# Altium schematic sheet EIS_Main_MSP430F6638.SchDoc: EIS: CPU
size A4; FaxNumber: +49 7721 943 210; Organization: Hahn-Schickard; Address1: Wilhelm-Schickard-Str. 10; Address2: 78052 Villingen-Schwenningen; Address3: Bernd.Ehrbrecht@Hahn-Schickard.de; DocumentNumber: 1; Revision: 1.0; SheetNumber: 2; SheetTotal: 7; PhoneNumber: 0 7721 943 137; E-Mail: Xxxx.Xxxx@Hahn-Schickard.de; ProjectName: Project File Name
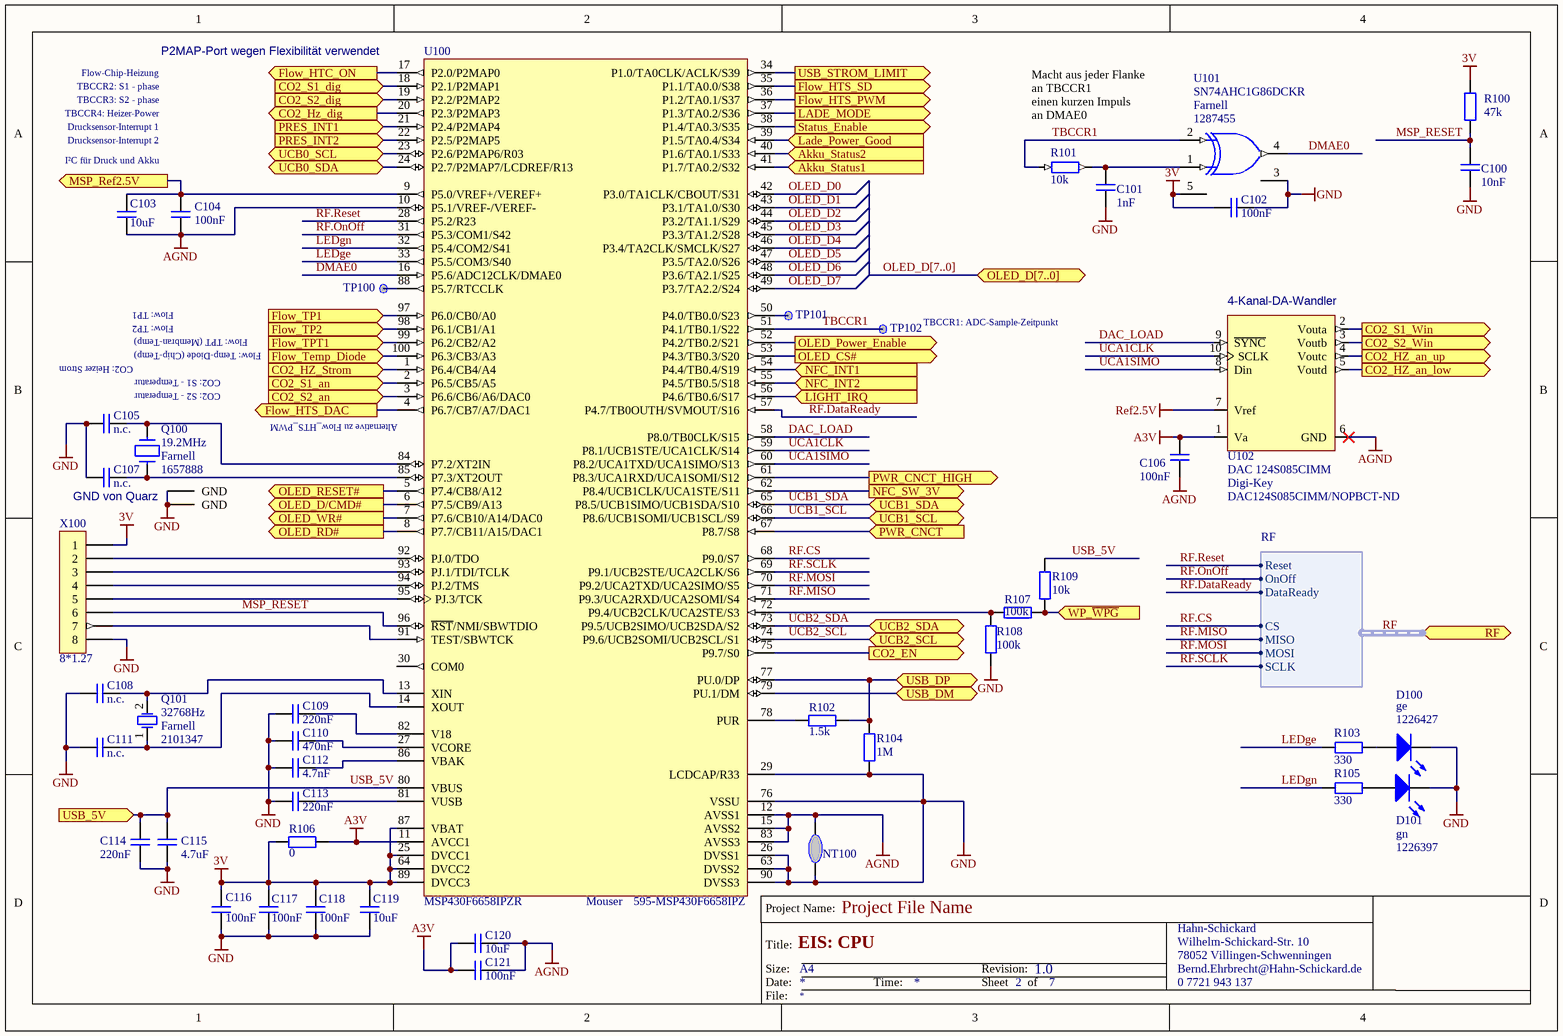
[diagram p0: EIS_Main_MSP430F6638.SchDoc]

## Parts
C100  10nF  [CAPC1608N]
C101  1nF  [CAPC1608N]
C102  100nF  [CAPC1608N]
C103  10uF  [CAPC1608N]
C104  100nF  [CAPC1608N]
C105  n.c.  [CAPC1608N]
C106  100nF  [CAPC1608N]
C107  n.c.  [CAPC1608N]
C108  n.c.  [CAPC1608N]
C109  220nF  [CAPC1608N]
C110  470nF  [CAPC1608N]
C111  n.c.  [CAPC1608N]
C112  4.7nF  [CAPC1608N]
C113  220nF  [CAPC1608N]
C114  220nF  [CAPC1608N]
C115  4.7uF  [CAPC1608N]
C116  100nF  [CAPC1608N]
C117  100nF  [CAPC1608N]
C118  100nF  [CAPC1608N]
C119  10uF  [CAPC1608N]
C120  10uF  [CAPC1608N]
C121  100nF  [CAPC1608N]
D100  ge  Supplier Part Number 1: 1226427  [LED-Gelb]
D101  gn  Supplier Part Number 1: 1226397  [LED-gruen]
NT100  Net Tie without Boom  [NetTie]  (value not drawn)  (net tie, no BOM)
Q100  19.2MHz  Supplier 1: Farnell  Supplier Part Number 1: 1657888  [Quarz 4 Pin 2.5mm*2mm]
Q101  32768Hz  Supplier 1: Farnell  Supplier Part Number 1: 2101347  [ABS07]
R100  47k  [RESC1608N]
R101  10k  [RESC1608N]
R102  1.5k  [RESC1608N]
R103  330  [RESC1608N]
R104  1M  [RESC1608N]
R105  330  [RESC1608N]
R106  0  [RESC1608N]
R107  100k  [RESC1608N]
R108  100k  [RESC1608N]
R109  10k  [RESC1608N]
TP100  Testpoint 1mm  [Testpoint 1mm]  (value not drawn)  (no BOM)
TP101  Testpoint 1mm  [Testpoint 1mm]  (value not drawn)  (no BOM)
TP102  Testpoint 1mm  [Testpoint 1mm]  (value not drawn)  (no BOM)
U100  MSP430F6658IPZR  Supplier 1: Mouser  Supplier Part Number 1: 595-MSP430F6658IPZ  [TI-PZ100_N]
U101  SN74AHC1G86DCKR  Supplier 1: Farnell  Supplier Part Number 1: 1287455  [419A-01_N]
U102  DAC 124S085CIMM  Supplier1: Digi-Key  Supplier Part Number 1: DAC124S085CIMM/NOPBCT-ND  [MSOP-DGS]
X100  8*1.27  [JMP 8x1.27]

## Ports
Akku_Status1 (in), Akku_Status2 (in), CO2_EN (out), CO2_HZ_an_low (out), CO2_HZ_an_up (out), CO2_Hz_dig (out), CO2_HZ_Strom (in), CO2_S1_an (in), CO2_S1_dig (in), CO2_S1_Win (out), CO2_S2_an (in), CO2_S2_dig (in), CO2_S2_Win (out), Flow_HTC_ON (out), Flow_HTS_DAC (out), Flow_HTS_PWM (out), Flow_HTS_SD (out), Flow_Temp_Diode (in), Flow_TP1 (in), Flow_TP2 (in), Flow_TPT1 (in), LADE_MODE (out), Lade_Power_Good (in), LIGHT_IRQ (in), MSP_Ref2.5V (out), NFC_INT1 (in), NFC_INT2 (in), NFC_SW_3V (out), OLED_CS# (out), OLED_D/CMD# (out), OLED_D[7..0] (bidir), OLED_Power_Enable (out), OLED_RD# (out), OLED_RESET# (out), OLED_WR# (out), PRES_INT1 (in), PRES_INT2 (in), PWR_CNCT (in), PWR_CNCT_HIGH (out), RF (harness RF), Status_Enable (out), UCB0_SCL (bidir), UCB0_SDA (bidir), UCB1_SCL (bidir), UCB1_SDA (bidir), UCB2_SCL (bidir), UCB2_SDA (bidir), USB_5V (in), USB_DM (bidir), USB_DP (bidir), USB_STROM_LIMIT (out), WP_~{WPG} (in)

## Harnesses
RF: SCLK, MOSI, MISO, CS, DataReady, OnOff, Reset

## Nets
3V: C102.1 C116.1 C117.1 C118.1 C119.1 R100.2 R106.1 U100.25(DVCC1) U100.64(DVCC2) U100.87(VBAT) U100.89(DVCC3) U101.5(VDD) X100.1
A3V: C106.2 C120.2 C121.1 R106.2 U100.11(AVCC1) U102.1(Va)
AGND: C103.2 C104.2 C106.1 C120.1 C121.2 NT100.2 U100.10(P5.1/VREF-/VEREF-) U100.12(AVSS1) U100.15(AVSS2) U100.83(AVSS3) U102.6(GND)
GND: C100.2 C101.1 C102.2 C105.1 C107.1 C108.2 C109.1 C110.2 C111.1 C112.2 C113.1 C114.2 C115.2 C116.2 C117.2 C118.2 C119.2 D100.2 D101.2 NT100.1 Q100.2(GND) Q100.4(GND) R104.1 R108.1 U100.26(DVSS1) U100.29(LCDCAP/R33) U100.63(DVSS2) U100.76(VSSU) U100.90(DVSS3) U101.3(GND) X100.8
Ref2.5V: U102.7(Vref)
Akku_Status1: U100.41(P1.7/TA0.2/S32) ; port Akku_Status1
Akku_Status2: U100.40(P1.6/TA0.1/S33) ; port Akku_Status2
CO2_EN: U100.75(P9.7/S0) ; port CO2_EN
CO2_HZ_an_low: U102.5(Voutd) ; port CO2_HZ_an_low
CO2_HZ_an_up: U102.4(Voutc) ; port CO2_HZ_an_up
CO2_Hz_dig: U100.20(P2.3/P2MAP3) ; port CO2_Hz_dig
CO2_HZ_Strom: U100.1(P6.4/CB4/A4) ; port CO2_HZ_Strom
CO2_S1_an: U100.2(P6.5/CB5/A5) ; port CO2_S1_an
CO2_S1_dig: U100.18(P2.1/P2MAP1) ; port CO2_S1_dig
CO2_S1_Win: U102.2(Vouta) ; port CO2_S1_Win
CO2_S2_an: U100.3(P6.6/CB6/A6/DAC0) ; port CO2_S2_an
CO2_S2_dig: U100.19(P2.2/P2MAP2) ; port CO2_S2_dig
CO2_S2_Win: U102.3(Voutb) ; port CO2_S2_Win
DAC_LOAD: U100.58(P8.0/TB0CLK/S15) U102.9(~{SYNC})
DMAE0: U100.16(P5.6/ADC12CLK/DMAE0) U101.4(Y)
Flow_HTC_ON: U100.17(P2.0/P2MAP0) ; port Flow_HTC_ON
Flow_HTS_DAC: U100.4(P6.7/CB7/A7/DAC1) ; port Flow_HTS_DAC
Flow_HTS_PWM: U100.36(P1.2/TA0.1/S37) ; port Flow_HTS_PWM
Flow_HTS_SD: U100.35(P1.1/TA0.0/S38) ; port Flow_HTS_SD
Flow_Temp_Diode: U100.100(P6.3/CB3/A3) ; port Flow_Temp_Diode
Flow_TP1: U100.97(P6.0/CB0/A0) ; port Flow_TP1
Flow_TP2: U100.98(P6.1/CB1/A1) ; port Flow_TP2
Flow_TPT1: U100.99(P6.2/CB2/A2) ; port Flow_TPT1
LADE_MODE: U100.37(P1.3/TA0.2/S36) ; port LADE_MODE
Lade_Power_Good: U100.39(P1.5/TA0.4/S34) ; port Lade_Power_Good
LEDge: R103.2 U100.33(P5.5/COM3/S40)
LEDgn: R105.2 U100.32(P5.4/COM2/S41)
LIGHT_IRQ: U100.56(P4.6/TB0.6/S17) ; port LIGHT_IRQ
MSP_Ref2.5V: C103.1 C104.1 U100.9(P5.0/VREF+/VEREF+) ; port MSP_Ref2.5V
MSP_RESET: C100.1 R100.1 U100.96(~{RST}/NMI/SBWTDIO) X100.6
NFC_INT1: U100.54(P4.4/TB0.4/S19) ; port NFC_INT1
NFC_INT2: U100.55(P4.5/TB0.5/S18) ; port NFC_INT2
NFC_SW_3V: U100.62(P8.4/UCB1CLK/UCA1STE/S11) ; port NFC_SW_3V
OLED_CS#: U100.53(P4.3/TB0.3/S20) ; port OLED_CS#
OLED_D0: U100.42(P3.0/TA1CLK/CBOUT/S31)
OLED_D1: U100.43(P3.1/TA1.0/S30)
OLED_D2: U100.44(P3.2/TA1.1/S29)
OLED_D3: U100.45(P3.3/TA1.2/S28)
OLED_D4: U100.46(P3.4/TA2CLK/SMCLK/S27)
OLED_D5: U100.47(P3.5/TA2.0/S26)
OLED_D6: U100.48(P3.6/TA2.1/S25)
OLED_D7: U100.49(P3.7/TA2.2/S24)
OLED_D/CMD#: U100.6(P7.5/CB9/A13) ; port OLED_D/CMD#
OLED_Power_Enable: U100.52(P4.2/TB0.2/S21) ; port OLED_Power_Enable
OLED_RD#: U100.8(P7.7/CB11/A15/DAC1) ; port OLED_RD#
OLED_RESET#: U100.5(P7.4/CB8/A12) ; port OLED_RESET#
OLED_WR#: U100.7(P7.6/CB10/A14/DAC0) ; port OLED_WR#
PRES_INT1: U100.21(P2.4/P2MAP4) ; port PRES_INT1
PRES_INT2: U100.22(P2.5/P2MAP5) ; port PRES_INT2
PWR_CNCT: U100.67(P8.7/S8) ; port PWR_CNCT
PWR_CNCT_HIGH: U100.61(P8.3/UCA1RXD/UCA1SOMI/S12) ; port PWR_CNCT_HIGH
RF.CS: U100.68(P9.0/S7) ; port RF.CS
RF.DataReady: U100.57(P4.7/TB0OUTH/SVMOUT/S16) ; port RF.DataReady
RF.MISO: U100.71(P9.3/UCA2RXD/UCA2SOMI/S4) ; port RF.MISO
RF.MOSI: U100.70(P9.2/UCA2TXD/UCA2SIMO/S5) ; port RF.MOSI
RF.OnOff: U100.31(P5.3/COM1/S42) ; port RF.OnOff
RF.Reset: U100.28(P5.2/R23) ; port RF.Reset
RF.SCLK: U100.69(P9.1/UCB2STE/UCA2CLK/S6) ; port RF.SCLK
Status_Enable: U100.38(P1.4/TA0.3/S35) ; port Status_Enable
TBCCR1: R101.2 TP102.1 U100.51(P4.1/TB0.1/S22) U101.2(A)
UCA1CLK: U100.59(P8.1/UCB1STE/UCA1CLK/S14) U102.10(SCLK)
UCA1SIMO: U100.60(P8.2/UCA1TXD/UCA1SIMO/S13) U102.8(Din)
UCB0_SCL: U100.23(P2.6/P2MAP6/R03) ; port UCB0_SCL
UCB0_SDA: U100.24(P2.7/P2MAP7/LCDREF/R13) ; port UCB0_SDA
UCB1_SCL: U100.66(P8.6/UCB1SOMI/UCB1SCL/S9) ; port UCB1_SCL
UCB1_SDA: U100.65(P8.5/UCB1SIMO/UCB1SDA/S10) ; port UCB1_SDA
UCB2_SCL: U100.74(P9.6/UCB2SOMI/UCB2SCL/S1) ; port UCB2_SCL
UCB2_SDA: U100.73(P9.5/UCB2SIMO/UCB2SDA/S2) ; port UCB2_SDA
USB_5V: C114.1 C115.1 R109.1 U100.80(VBUS) ; port USB_5V
USB_DM: U100.79(PU.1/DM) ; port USB_DM
USB_DP: R102.1 R104.2 U100.77(PU.0/DP) ; port USB_DP
USB_STROM_LIMIT: U100.34(P1.0/TA0CLK/ACLK/S39) ; port USB_STROM_LIMIT
WP_~{WPG}: R107.1 R109.2 ; port WP_~{WPG}
NetC101_2: C101.2 R101.1 U101.1(B)
NetC105_2: C105.2 Q100.3 U100.84(P7.2/XT2IN)
NetC107_2: C107.2 Q100.1 U100.85(P7.3/XT2OUT)
NetC108_1: C108.1 Q101.2(OSC2) U100.13(XIN)
NetC109_2: C109.2 U100.82(V18)
NetC110_1: C110.1 U100.27(VCORE)
NetC111_2: C111.2 Q101.1(OSC1) U100.14(XOUT)
NetC112_1: C112.1 U100.86(VBAK)
NetC113_2: C113.2 U100.81(VUSB)
NetD100_1: D100.1 R103.1
NetD101_1: D101.1 R105.1
NetR102_2: R102.2 U100.78(PUR)
NetR107_2: R107.2 R108.2 U100.72(P9.4/UCB2CLK/UCA2STE/S3)
NetTP100_1: TP100.1 U100.88(P5.7/RTCCLK)
NetTP101_1: TP101.1 U100.50(P4.0/TB0.0/S23)
NetU100_91: U100.91(TEST/SBWTCK) X100.7
NetU100_92: U100.92(PJ.0/TDO) X100.2
NetU100_93: U100.93(PJ.1/TDI/TCLK) X100.3
NetU100_94: U100.94(PJ.2/TMS) X100.4
NetU100_95: U100.95(PJ.3/TCK) X100.5

Not connected (* = marked no-connect by the designer): U100 30(COM0)

## Buses and harness runs
bus OLED_D[7..0] = port OLED_D[7..0]
harness RF = port RF

## Notes on the sheet
- TBCCR3: S2 - phase
- TBCCR2: S1 - phase
- TBCCR4: Heizer-Power
- Flow-Chip-Heizung
- (near U100) P2MAP-Port wegen Flexibilität verwendet
- Macht aus jeder Flanke
  an TBCCR1
  einen kurzen Impuls
  an DMAE0
- Drucksensor-Interrupt 1
- Drucksensor-Interrupt 2
- I²C für Druck und Akku
- Flow: TP1
- (near U102) 4-Kanal-DA-Wandler
- CO2: Heizer Strom
- Flow: TP2
- CO2: S1 - Temperatur
- CO2: S2 - Temperatur
- Flow: TPT (Membran-Temp)
- Flow: Temp-Diode (Chip-Temp)
- (near TP102) TBCCR1: ADC-Sample-Zeitpunkt
- (near U100) Alternative zu Flow_HTS_PWM
- (near Q100) GND von Quarz
- Project Name:
- Size:
- Date:
- Title:
- A4
- Time:
- Revision:
- Sheet
- of
- File:

## Library data of the parts
C100 = Kondensator SMD Keramik: 07_Lieferant: Digi-Key; 08_Lieferanten_Nummer: 399-1091-1-ND
C101 = Kondensator SMD Keramik: 07_Lieferant: Digi-Key; 08_Lieferanten_Nummer: 399-1082-1-ND
C102 C104 C106 C116-C118 C121 = Kondensator SMD Keramik: 07_Lieferant: Digi-Key; 08_Lieferanten_Nummer: 399-1096-1-ND
C103 C119 C120 = Kondensator SMD Keramik: 07_Lieferant: Digi-Key; 08_Lieferanten_Nummer: 490-7201-1-ND
C105 C107 C108 C111 = Kondensator SMD Keramik
C109 C113 C114 = Kondensator SMD Keramik: 07_Lieferant: Digi-Key; 08_Lieferanten_Nummer: 445-1318-1-ND
C110 = Kondensator SMD Keramik: 07_Lieferant: Digi-Key; 08_Lieferanten_Nummer: 445-5152-1-ND
C112 = Kondensator SMD Keramik: 07_Lieferant: Digi-Key; 08_Lieferanten_Nummer: 1276-1098-1-ND
C115 = Kondensator SMD Keramik: 07_Lieferant: Digi-Key; 08_Lieferanten_Nummer: 1276-2087-1-ND
D100 D101 = LED SMD: 07_Lieferant: Farnell; Supplier 1: Farnell
  D100: 08_Lieferanten_Nummer: 1226427
  D101: 08_Lieferanten_Nummer: 1226397
NT100 = Net Tie without Boom: 09_Ersteller: HSG Jürgen Merz; 02_Herstellerbezeichnung: ka; 10_Erstell_Datum: 28.09.2009
Q100 = QUARZ: 07_Lieferant: Farnell; 08_Lieferanten_Nummer: 1657888
Q101 = XTAL: Uhren Quarz - Crystal; Published: 8-Jun-2000; LatestRevisionDate: 17-Jul-2002; LatestRevisionNote: Re-released for DXP Platform.; PackageReference: R38; Publisher: Altium Limited; PackageDescription: Crystal, Thru-Hole; 2 Leads; Body 3.1 x 8.2 mm (Dia.xH); 07_Lieferant: Farnell; 08_Lieferanten_Nummer: 2101347
R100 = Widerstand SMD: 07_Lieferant: Digi-Key; 08_Lieferanten_Nummer: 311-47KGRCT-ND
R101 R109 = Widerstand SMD: 07_Lieferant: Digi-Key; 08_Lieferanten_Nummer: 311-10KGRCT-ND
R102 = Res2: Resistor; 07_Lieferant: Digi-Key; 08_Lieferanten_Nummer: RG16P1.5KBTR-ND; Published: 8-Jun-2000; LatestRevisionDate: 17-Jul-2002; LatestRevisionNote: Re-released for DXP Platform.; PackageReference: AXIAL-0.4; Publisher: Altium Limited; Value: 1.5k
R103 R105 = Widerstand SMD: 07_Lieferant: Digi-Key; 08_Lieferanten_Nummer: 311-330GRCT-ND
R104 = Widerstand SMD: 07_Lieferant: Digi-Key; 08_Lieferanten_Nummer: 311-1.00MHRCT-ND
R106 = RESC1608 (R0603): 07_Lieferant: Farnell; 08_Lieferanten_Nummer: 2059527; Supplier 1: Farnell; Supplier Part Number 1: 2008343
R107 R108 = Res2: Resistor; 07_Lieferant: Digi-Key; 08_Lieferanten_Nummer: 311-100KGRCT-ND; Published: 8-Jun-2000; LatestRevisionDate: 17-Jul-2002; LatestRevisionNote: Re-released for DXP Platform.; PackageReference: AXIAL-0.4; Publisher: Altium Limited; Value: 100k
TP100-TP102 = Tespoint 1mm: Published: 17.09.2009; Publisher: HSG Jürgen MErz
U100 = MSP430F6658IPZR: 20 MHz Mixed Signal Microcontroller with 256 KB Flash, 16384 B SRAM and 74 GPIOs, -40 to 85 degC, 100-pin QFP (PZ), Green (RoHS & no Sb/Br); Manufacturer: Texas Instruments; PartNumber: MSP430F6638IPZR; ADC: 12-bit SAR; ADC Channels: 16; Brown Out Reset: Yes; DAC: 2; DMA: 3; Flash(KB): 256; Frequency(MHz): 20; GPIO: 74; Multiplier: 32x32; Real-Time Clock: Yes, with battery backup; SRAM(B): 16384; SubFamily: 6 Series with LCD; Timers - 16-bit: 4; USB: 1; DatasheetVersion: SLAS566C; PackageVersion: 4040149/B; PackageReference: PZ100; PackageDescription: 100-Pin Plastic Flat Pack, Body 14 x 14 mm, Pitch 0.5 mm; Comparators: Yes; Eco-Plan: Green (RoHS & no Sb/Br); SVS: Yes; Temp Sensor: Yes; USCI_A (UART/LIN/IrDA/SPI): 2; USCI_B (I2C & SPI): 2; Watchdog: Yes; Mounting Technology: Surface Mount; Code_JEDEC: MS-026; ComponentLink1Description: Manufacturer URL; ComponentLink1URL: http://www.ti.com/; ComponentLink2Description: Datasheet; ComponentLink2URL: http://www.ti.com/general/docs/lit/getliterature.tsp?genericPartNumber=MSP430F6638&fileType=pdf; ComponentLink3Description: Package Specification; ComponentLink3URL: http://www.ti.com/lit/ml/mtqf013a/mtqf013a.pdf; 07_Lieferant: Mouser; 08_Lieferanten_Nummer: 595-MSP430F6658IPZ
U101 = MC74VHC1G86DFT1: 2-Input XOR Gate; Published: 15-Apr-2002; LatestRevisionDate: 12-Dec-2006; LatestRevisionNote: IPC-7351 Footprint Added.; DatasheetVersion: Dec-1999; PackageVersion: Oct-1999; PackageReference: 419A-01; Publisher: Altium Limited; PackageDescription: 5-Pin SOT-353 Package 0.65 mm Pitch, 2.1 mm Lead Span; ComponentLink1Description: Manufacturer Link; ComponentLink1URL: http://www.onsemi.com/; ComponentLink2Description: Datasheet; ComponentLink2URL: http://www.onsemi.com/pub/Collateral/MC74VHC1G86-D.PDF; 07_Lieferant: Farnell; 08_Lieferanten_Nummer: 1287455
U102 = DAC 124S085CIMM: DAC 4 Channel 12-Bit; 07_Lieferant: Digi-Key; 08_Lieferanten_Nummer: DAC124S085CIMM/NOPBCT-ND
X100 = JMP 8*1.27